# Altium schematic sheet Middle_TID.SchDoc
size A4
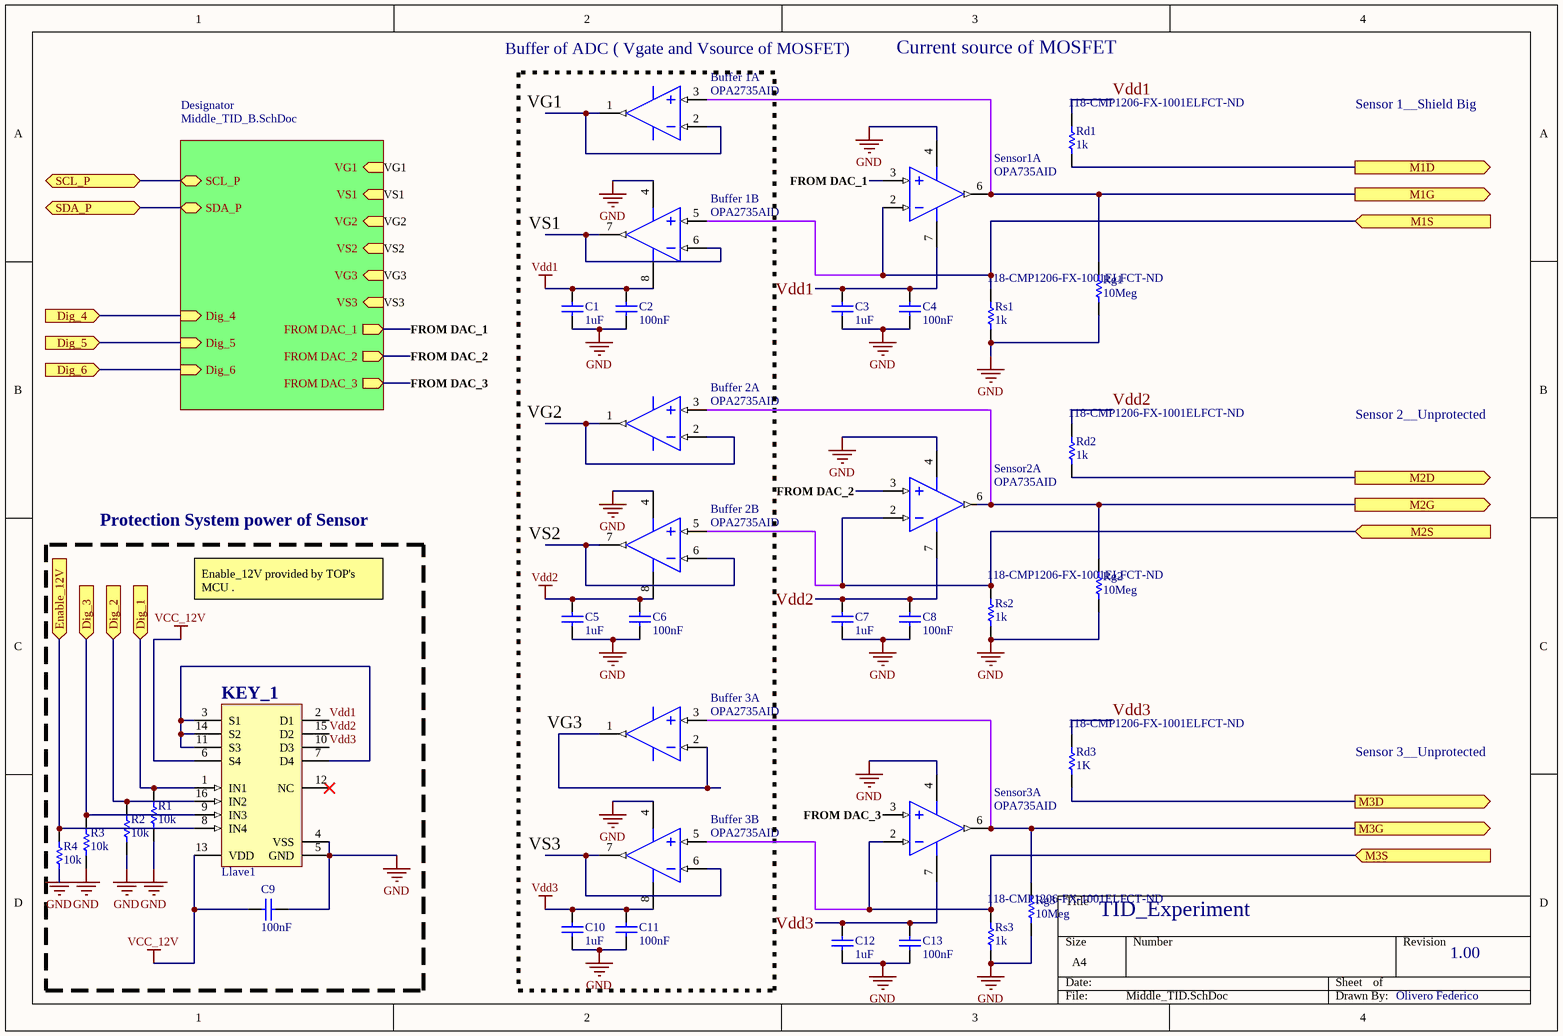
[diagram p0: Middle_TID.SchDoc]

## Parts
Buffer_1  OPA2735AID  [TI-D8_N]  (parts A,B of 2)
Buffer_2  OPA2735AID  [TI-D8_N]  (parts A,B of 2)
Buffer_3  OPA2735AID  [TI-D8_N]  (parts A,B of 2)
C1  1uF  [C1206]
C2  100nF  [C1206]
C3  1uF  [C1206]
C4  100nF  [C1206]
C5  1uF  [C1206]
C6  100nF  [C1206]
C7  1uF  [C1206]
C8  100nF  [C1206]
C9  100nF  [C1206]
C10  1uF  [C1206]
C11  100nF  [C1206]
C12  1uF  [C1206]
C13  100nF  [C1206]
KEY_1  Llave1  [ADI-RU-16_N]
R1  10k  [R1206]
R2  10k  [R1206]
R3  10k  [R1206]
R4  10k  [R1206]
Rd1  1k  Supplier Part Number 1: 118-CMP1206-FX-1001ELFCT-ND  [R1206]
Rd2  1k  Supplier Part Number 1: 118-CMP1206-FX-1001ELFCT-ND  [R1206]
Rd3  1K  Supplier Part Number 1: 118-CMP1206-FX-1001ELFCT-ND  [R1206]
Rg1  10Meg  [R1206]
Rg2  10Meg  [R1206]
Rg3  10Meg  [R1206]
Rs1  1k  Supplier Part Number 1: 118-CMP1206-FX-1001ELFCT-ND  [R1206]
Rs2  1k  Supplier Part Number 1: 118-CMP1206-FX-1001ELFCT-ND  [R1206]
Rs3  1k  Supplier Part Number 2: 118-CMP1206-FX-1001ELFCT-ND  [R1206]
Sensor1  OPA735AID  [TI-D8_N]  (part A of 2)
Sensor2  OPA735AID  [TI-D8_N]  (part A of 2)
Sensor3  OPA735AID  [TI-D8_N]  (part A of 2)

## Blocks framed on the sheet
Protection System power of Sensor: C9 KEY_1 R1-R4

## Sub-sheets
Designator = Middle_TID_B.SchDoc: VG1 (in), VS1 (in), VG2 (in), VS2 (in), VG3 (in), VS3 (in), SCL_P (bidir), SDA_P (bidir), FROM DAC_1 (out), Dig_4 (in), Dig_5 (in), Dig_6 (in), FROM DAC_2 (out), FROM DAC_3 (out)

## Ports
Dig_1 (in), Dig_2 (in), Dig_3 (in), Dig_4 (in), Dig_5 (in), Dig_6 (in), Enable_12V (in), M1D (out), M1G (out), M1S (in), M2D (out), M2G (out), M2S (in), M3D (out), M3G (out), M3S (in), SCL_P (bidir), SDA_P (bidir)

## Nets
GND: Buffer_1.4(V-) Buffer_2.4(V-) Buffer_3.4(V-) C1.1 C2.1 C3.1 C4.1 C5.1 C6.1 C7.1 C8.1 C9.1 C10.1 C11.1 C12.1 C13.1 KEY_1.4(VSS) KEY_1.5(GND) R1.1 R2.1 R3.1 R4.1 Rg1.1 Rg2.1 Rg3.1 Rs1.1 Rs2.1 Rs3.1 Sensor1.4(V-) Sensor2.4(V-) Sensor3.4(V-)
VCC_12V: C9.2 KEY_1.6(S4) KEY_1.13(VDD)
Vdd1: Buffer_1.8(V+) C1.2 C2.2 C3.2 C4.2 KEY_1.2(D1) Rd1.2 Sensor1.7(V+)
Vdd2: Buffer_2.8(V+) C5.2 C6.2 C7.2 C8.2 KEY_1.15(D2) Rd2.2 Sensor2.7(V+)
Vdd3: Buffer_3.8(V+) C10.2 C11.2 C12.2 C13.2 KEY_1.10(D3) Rd3.2 Sensor3.7(V+)
Dig_1: KEY_1.1(IN1) R1.2 ; port Dig_1
Dig_2: KEY_1.16(IN2) R2.2 ; port Dig_2
Dig_3: KEY_1.9(IN3) R3.2 ; port Dig_3
Dig_4: port Dig_4, sheet Designator/Dig_4
Dig_5: port Dig_5, sheet Designator/Dig_5
Dig_6: port Dig_6, sheet Designator/Dig_6
Enable_12V: KEY_1.8(IN4) R4.2 ; port Enable_12V
FROM DAC_1: Sensor1.3(IN+) ; sheet Designator/FROM DAC_1
FROM DAC_2: Sensor2.3(IN+) ; sheet Designator/FROM DAC_2
FROM DAC_3: Sensor3.3(IN+) ; sheet Designator/FROM DAC_3
M1D: Rd1.1 ; port M1D
M1G: Buffer_1.3(IN_A+) Rg1.2 Sensor1.6(OUT) ; port M1G
M1S: Buffer_1.5(IN_B+) Rs1.2 Sensor1.2(IN-) ; port M1S
M2D: Rd2.1 ; port M2D
M2G: Buffer_2.3(IN_A+) Rg2.2 Sensor2.6(OUT) ; port M2G
M2S: Buffer_2.5(IN_B+) Rs2.2 Sensor2.2(IN-) ; port M2S
M3D: Rd3.1 ; port M3D
M3G: Buffer_3.3(IN_A+) Rg3.2 Sensor3.6(OUT) ; port M3G
M3S: Buffer_3.5(IN_B+) Rs3.2 Sensor3.2(IN-) ; port M3S
SCL_P: port SCL_P, sheet Designator/SCL_P
SDA_P: port SDA_P, sheet Designator/SDA_P
VG1: Buffer_1.1(OUT_A) Buffer_1.2(IN_A-) ; sheet Designator/VG1
VG2: Buffer_2.1(OUT_A) Buffer_2.2(IN_A-) ; sheet Designator/VG2
VG3: Buffer_3.1(OUT_A) Buffer_3.2(IN_A-) ; sheet Designator/VG3
VS1: Buffer_1.6(IN_B-) Buffer_1.7(OUT_B) ; sheet Designator/VS1
VS2: Buffer_2.6(IN_B-) Buffer_2.7(OUT_B) ; sheet Designator/VS2
VS3: Buffer_3.6(IN_B-) Buffer_3.7(OUT_B) ; sheet Designator/VS3
NetKEY_1_3: KEY_1.3(S1) KEY_1.7(D4) KEY_1.11(S3) KEY_1.14(S2)

Not connected (* = marked no-connect by the designer): KEY_1 12(NC)*

## Notes on the sheet
- (near Buffer_1) Buffer of ADC ( Vgate and Vsource of MOSFET)
- Current source of MOSFET
- Sensor 1__Shield Big
- Sensor 2__Unprotected
- Enable_12V provided by TOP's MCU .
- Sensor 3__Unprotected
- TID_Experiment
- 1.00
- Olivero Federico

## Library data of the parts
Buffer_1-Buffer_3 = OPA2735AID: 0.05 uV/degC (max) Single-Supply CMOS Operational Amplifier, Zero-Drift Series, 2.7 to 12 V, -40 to 85 degC, 8-pin SOIC (D8), Green (RoHS & no Sb/Br); Manufacturer: Texas Instruments; CMRR(Min)(dB): 115; GBW(Typ)(MHz): 1.6; IIB(Max)(pA): 200; Iq per channel(Max)(mA): 0.75; Number of Channels: 2; Offset Drift(Typ)(uV/C): 0.01; Packing: TUBE; Rating: Catalog; Slew Rate(Typ)(V/us): 1.5; Sub Family: Low Offset Voltage Amplifier (<=500uV), Low Supply Voltage Amplifier (<=2.7V), Precision Amplifier, Zero Drift Precision Amplifier; Total Supply Voltage(Max)(+5V is 5, +/-5V is 10): 12; Total Supply Voltage(Min)(+5V is 5, +/-5V is 10): 2.7; Vio (25C)(Max)(mV): 0.005; DatasheetVersion: SBOS282B; PackageVersion: 4040047-3/M, 06/2011; PackageReference: D8; PackageDescription: 8-Pin Plastic Small Outline, Body 4.9 x 3.9 mm, Pitch 1.27 mm; Supplier 1: Digi-Key; Supplier Part Number 1: 296-16770-5-ND; Supplier 2: Newark; Supplier Part Number 2: 01J0602; Supplier 3: Mouser; Supplier Part Number 3: 595-OPA2735AID; Eco-Plan: Green (RoHS & no Sb/Br); Mounting Technology: Surface Mount; Code_JEDEC: MS-012; PartNumber: OPA2735AID; ComponentLink1Description: Manufacturer URL; ComponentLink1URL: http://www.ti.com/; ComponentLink2Description: Datasheet; ComponentLink2URL: http://www.ti.com/lit/ds/symlink/opa2735.pdf; ComponentLink3Description: Package Specification; ComponentLink3URL: http://www.ti.com/litv/pdf/msoi002j
C1-C13 = C1206: 1206 Capacitor
  C1 C3 C5 C7 C10: Supplier 1: Digi-Key; Supplier Part Number 1: 399-1255-1-ND
  C2 C4 C6 C8 C9 C11 C13: Supplier 1: Digi-Key; Supplier Part Number 1: 478-1556-1-ND
KEY_1 = ADG5412BRUZ: High Voltage Latch-Up Proof, Quad SPST Switches, -40 to 125 degC, 16-pin SOP (RU-16), Tube; Manufacturer: Analog Devices; Id, Is (ON): 100pA, 100pA, 100pA, 100pA; Is OFF: 50pA, 50pA, 50pA, 50pA; Power Dissipation: 1mW; Ron (ohms): 9; DatasheetVersion: Rev. A; PackageVersion: Nov-02; PackageReference: RU-16; PackageDescription: 16-Pin Thin Shrink Small Outline Package, Body 5 x 4.4 mm, Pitch 0.65 mm; Supplier 1: Digi-Key; Supplier Part Number 1: ADG5412BRUZ-ND; Supplier 2: Farnell; Supplier Part Number 2: 2081057; Supplier 3: Newark; Supplier Part Number 3: 85R6320; Supplier 4: Mouser; Supplier Part Number 4: 584-ADG5412BRUZ; Configuration: SPST; Packing: Tube; Mounting Technology: Surface Mount; Code_JEDEC: MO-153AB; PartNumber: ADG5412BRUZ; ComponentLink1Description: Manufacturer URL; ComponentLink1URL: http://www.analog.com/en/index.html; ComponentLink2Description: Datasheet; ComponentLink2URL: http://www.analog.com/static/imported-files/data_sheets/ADG5412_5413.pdf; ComponentLink3Description: Package Specification; ComponentLink3URL: http:/www.analog.com/static/imported-files/packages/36244347913743854010197452789RU16.pdf
R1-R4 = R1206: 1206 Resistor; Value: *; Supplier 1: Digi-Key; Supplier Part Number 1: 541-CRCW120610K0JNTACT-ND
Rd1-Rd3 Rg1-Rg3 Rs1-Rs3 = R1206: 1206 Resistor  1% CMP2010A 1Watt 100ppm; Value: *
  Rd1-Rd3 Rs1 Rs2: Supplier 1: Digi-Key
  Rg1: Supplier 1: DigiKey; Supplier Part Number 1: 541-CRCW120610M0FKEBCT-ND; Supplier 2: Digi-Key; Supplier Part Number 2: 541-10MECT-ND
  Rg2 Rg3: Supplier 1: Digi-Key; Supplier Part Number 1: 541-10MECT-ND
  Rs3: Supplier 1: Digi-Key; Supplier Part Number 1: 118-CMP2010AFX-1001ELFCT-ND; Supplier 2: Digi-Key
Sensor1-Sensor3 = OPA735AID: 0.05 uV/degC (Max), Single-Supply CMOS Zero-Drift Series Operational Amplifier, 2.7 to 12 V, -40 to 85 degC, 8-pin SOIC (D8), Green (RoHS & no Sb/Br); Manufacturer: Texas Instruments; CMRR(Min)(dB): 115; GBW(Typ)(MHz): 1.6; IIB(Max)(pA): 200; Iq per channel(Max)(mA): 0.75; Number of Channels: 1; Offset Drift(Typ)(uV/C): 0.01; Packing: TUBE; Rating: Catalog; Slew Rate(Typ)(V/us): 1.5; Sub Family: Low Offset Voltage Amplifier (<=500uV), Low Supply Voltage Amplifier (<=2.7V), Precision Amplifier, Zero Drift Precision Amplifier; Total Supply Voltage(Max)(+5V is 5, +/-5V is 10): 12; Total Supply Voltage(Min)(+5V is 5, +/-5V is 10): 2.7; Vio (25C)(Max)(mV): 0.005; DatasheetVersion: SBOS282B; PackageVersion: 4040047-3/M, 06/2011; PackageReference: D8; PackageDescription: 8-Pin Plastic Small Outline, Body 4.9 x 3.9 mm, Pitch 1.27 mm; Supplier 1: Digi-Key; Supplier Part Number 1: 296-17995-ND; Supplier 2: Farnell; Supplier Part Number 2: 1212328; Supplier 3: Newark; Supplier Part Number 3: 90H2263; Supplier 4: Mouser; Supplier Part Number 4: 595-OPA735AID; Eco-Plan: Green (RoHS & no Sb/Br); Mounting Technology: Surface Mount; Code_JEDEC: MS-012; PartNumber: OPA735AID; ComponentLink1Description: Manufacturer URL; ComponentLink1URL: http://www.ti.com/; ComponentLink2Description: Datasheet; ComponentLink2URL: http://www.ti.com/lit/ds/symlink/opa735.pdf; ComponentLink3Description: Package Specification; ComponentLink3URL: http://www.ti.com/litv/pdf/msoi002j